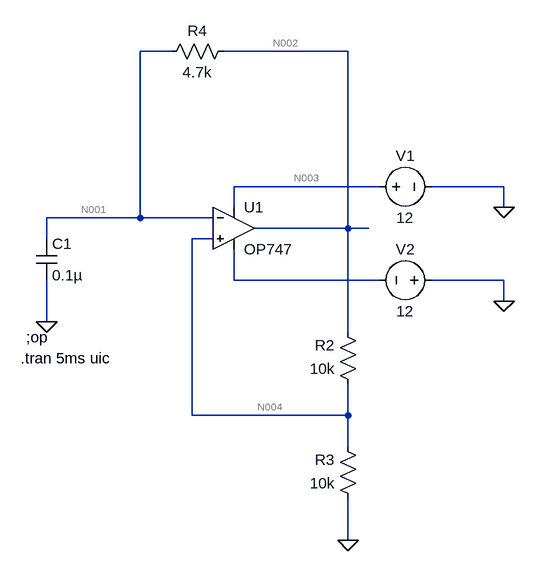
[diagram p0: schematic IC741_astable.asc]
IC741_astable.asc, the LTspice schematic file:
Version 4
SHEET 1 880 680
WIRE 64 -320 16 -320
WIRE 336 -320 144 -320
WIRE 384 -112 160 -112
WIRE 576 -112 464 -112
WIRE 160 -80 160 -112
WIRE 576 -80 576 -112
WIRE 16 -64 16 -320
WIRE 16 -64 -128 -64
WIRE 128 -64 16 -64
WIRE 336 -48 336 -320
WIRE 336 -48 192 -48
WIRE 368 -48 336 -48
WIRE -128 -32 -128 -64
WIRE 128 -32 96 -32
WIRE 160 32 160 -16
WIRE 384 32 160 32
WIRE 576 32 464 32
WIRE 576 64 576 32
WIRE -128 96 -128 32
WIRE 336 112 336 -48
WIRE 96 240 96 -32
WIRE 336 240 336 192
WIRE 336 240 96 240
WIRE 336 288 336 240
WIRE 336 432 336 368
FLAG -128 96 0
FLAG 576 -80 0
FLAG 576 64 0
FLAG 336 432 0
SYMBOL voltage 368 -112 R270
WINDOW 0 32 56 VTop 2
WINDOW 3 -32 56 VBottom 2
WINDOW 123 0 0 Left 0
WINDOW 39 0 0 Left 0
SYMATTR InstName V1
SYMATTR Value 12
SYMBOL voltage 480 32 R90
WINDOW 0 -32 56 VBottom 2
WINDOW 3 32 56 VTop 2
WINDOW 123 0 0 Left 0
WINDOW 39 0 0 Left 0
SYMATTR InstName V2
SYMATTR Value 12
SYMBOL OpAmps\\OP747 160 -112 R0
SYMATTR InstName U1
SYMBOL res 352 208 R180
WINDOW 0 36 76 Left 2
WINDOW 3 36 40 Left 2
SYMATTR InstName R2
SYMATTR Value 10k
SYMBOL res 352 384 R180
WINDOW 0 36 76 Left 2
WINDOW 3 36 40 Left 2
SYMATTR InstName R3
SYMATTR Value 10k
SYMBOL res 160 -336 R90
WINDOW 0 0 56 VBottom 2
WINDOW 3 32 56 VTop 2
SYMATTR InstName R4
SYMATTR Value 4.7k
SYMBOL cap -144 -32 R0
SYMATTR InstName C1
SYMATTR Value 0.1µ
TEXT -160 120 Left 2 !;op
TEXT -168 152 Left 2 !.tran 5ms uic

The netlist it stands for:
* IC741_astable.asc
V1 N003 0 12
V2 0 N005 12
XU1 N004 N001 N003 N005 N002 OP747  ; pins In+ In- V+ V- OUT
R2 N004 N002 10k
R3 0 N004 10k
R4 N002 N001 4.7k
C1 N001 0 0.1µ
;op
.tran 5ms uic
.backanno
.end

* Results of the author's LTspice run, read from the files saved beside the schematic
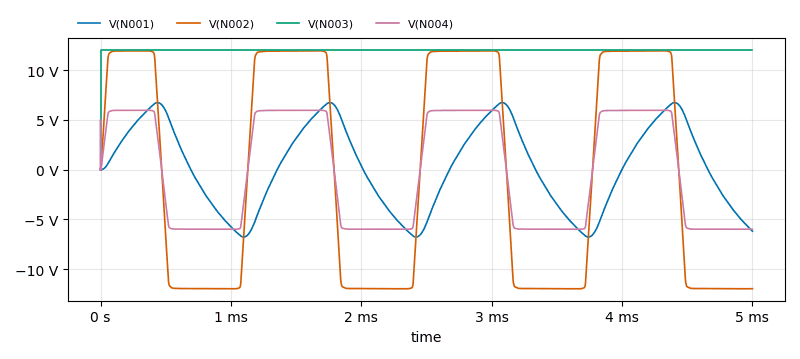
[diagram p1: Transient Analysis of IC741_astable.asc, plotted from the saved traces]
* Transient Analysis, 1 run:
*   V(N001): min -6.767 V, max 6.752 V, average 267.8 mV, rms 4.343 V, last -6.174 V
*   V(N002): min -11.97 V, max 11.96 V, average -313.6 mV, rms 11.24 V, last -11.96 V
*   V(N003): min 0 V, max 12 V, average 12 V, rms 12 V, last 12 V
*   V(N004): min -5.985 V, max 5.978 V, average -156.7 mV, rms 5.621 V, last -5.981 V